# Altium schematic sheet DDR3 RAM.SchDoc
size A3; Organization: Altium Limited; Address1: L3, 12a Rodborough Rd; Address2: Frenchs Forest; Address3: NSW; Address4: Australia 2086
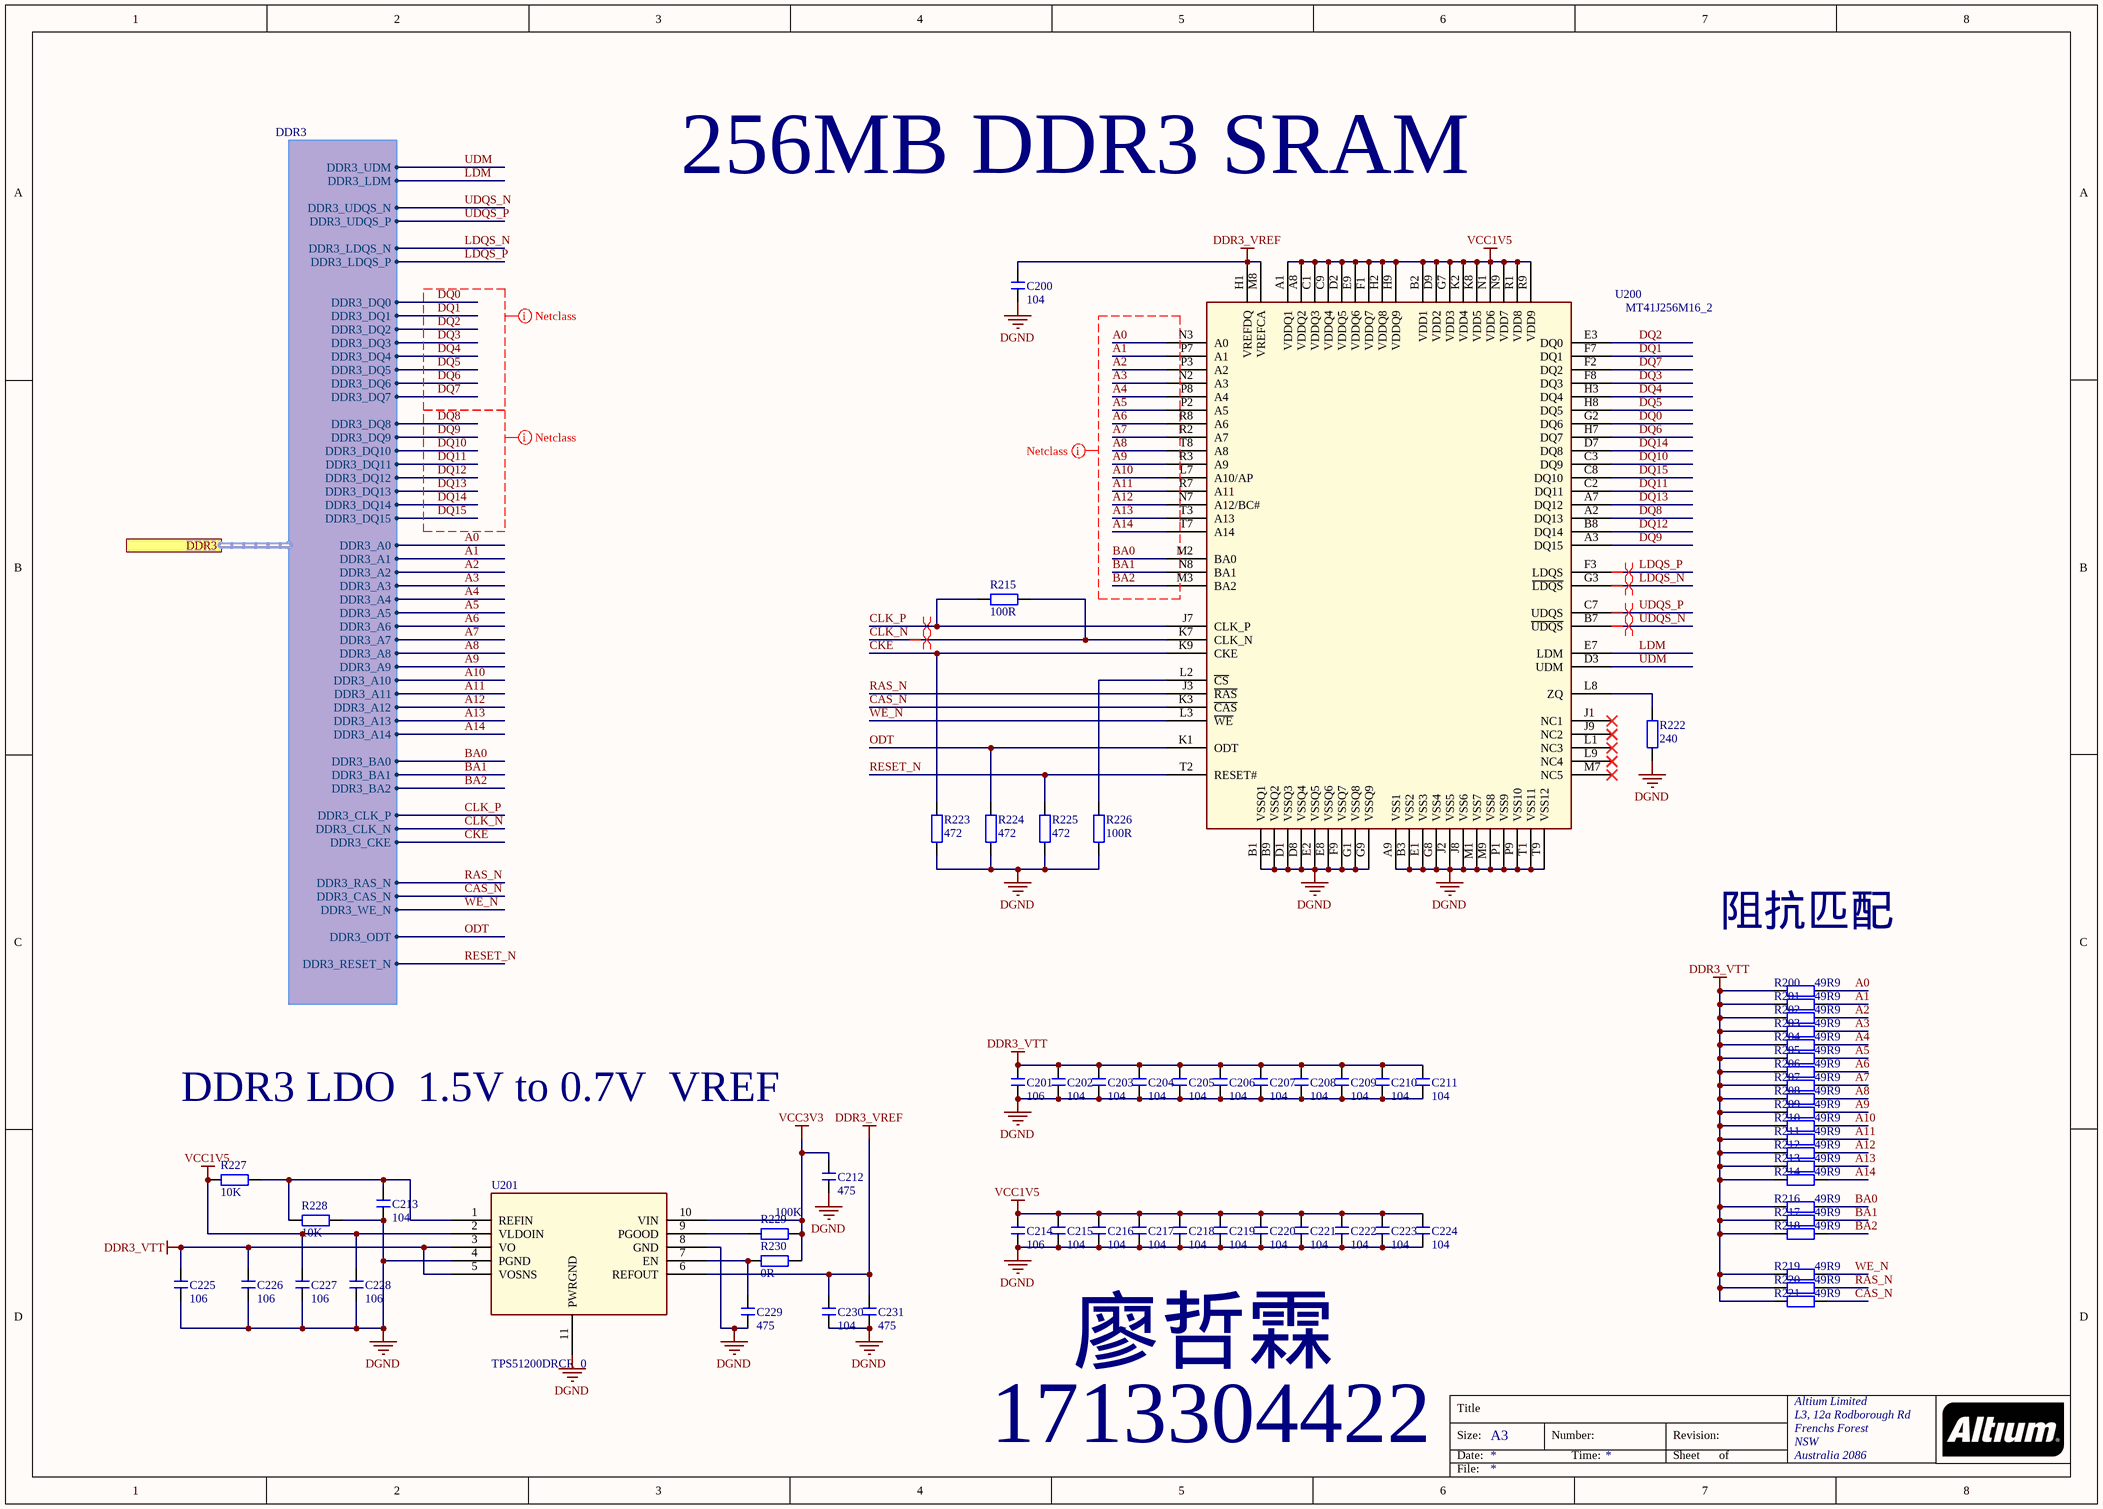
[diagram p0: DDR3 RAM.SchDoc]

## Parts
C200  104  [C 0402_M]
C201  106  [C 0402_M]
C202  104  [C 0402_M]
C203  104  [C 0402_M]
C204  104  [C 0402_M]
C205  104  [C 0402_M]
C206  104  [C 0402_M]
C207  104  [C 0402_M]
C208  104  [C 0402_M]
C209  104  [C 0402_M]
C210  104  [C 0402_M]
C211  104  [C 0402_M]
C212  475  [C 0402_M]
C213  104  [C 0402_M]
C214  106  [C 0402_M]
C215  104  [C 0402_M]
C216  104  [C 0402_M]
C217  104  [C 0402_M]
C218  104  [C 0402_M]
C219  104  [C 0402_M]
C220  104  [C 0402_M]
C221  104  [C 0402_M]
C222  104  [C 0402_M]
C223  104  [C 0402_M]
C224  104  [C 0402_M]
C225  106  [C 0402_M]
C226  106  [C 0402_M]
C227  106  [C 0402_M]
C228  106  [C 0402_M]
C229  475  [C 0402_M]
C230  104  [C 0402_M]
C231  475  [C 0402_M]
R200  49R9  [R 0402_M]
R201  49R9  [R 0402_M]
R202  49R9  [R 0402_M]
R203  49R9  [R 0402_M]
R204  49R9  [R 0402_M]
R205  49R9  [R 0402_M]
R206  49R9  [R 0402_M]
R207  49R9  [R 0402_M]
R208  49R9  [R 0402_M]
R209  49R9  [R 0402_M]
R210  49R9  [R 0402_M]
R211  49R9  [R 0402_M]
R212  49R9  [R 0402_M]
R213  49R9  [R 0402_M]
R214  49R9  [R 0402_M]
R215  100R  [R 0402_M]
R216  49R9  [R 0402_M]
R217  49R9  [R 0402_M]
R218  49R9  [R 0402_M]
R219  49R9  [R 0402_M]
R220  49R9  [R 0402_M]
R221  49R9  [R 0402_M]
R222  240  [R 0402_M]
R223  472  [R 0402_M]
R224  472  [R 0402_M]
R225  472  [R 0402_M]
R226  100R  [R 0402_M]
R227  10K  [R 0402_M]
R228  10K  [R 0402_M]
R229  100K  [R 0402_M]
R230  0R  [R 0402_M]
U200  MT41J256M16_2  [BGA96C80P9X16_750X1350X120]
U201  TPS51200DRCR_0  [SON50P300X300X100-11N-D]

## Ports
DDR3 (harness DDR3)

## Harnesses
DDR3: DDR3_CLK_P, DDR3_CLK_N, DDR3_CKE, DDR3_RAS_N, DDR3_CAS_N, DDR3_WE_N, DDR3_ODT, DDR3_RESET_N, DDR3_A0, DDR3_A1, DDR3_A2, DDR3_A3, DDR3_A4, DDR3_A5, DDR3_A6, DDR3_A7, DDR3_A8, DDR3_A9, DDR3_A10, DDR3_A11, DDR3_A12, DDR3_A13, DDR3_A14, DDR3_BA0, DDR3_BA1, DDR3_BA2, DDR3_LDQS_P, DDR3_LDQS_N, DDR3_LDM, DDR3_UDM, DDR3_UDQS_N, DDR3_UDQS_P, DDR3_DQ0, DDR3_DQ1, DDR3_DQ2, DDR3_DQ3, DDR3_DQ4, DDR3_DQ5, DDR3_DQ6, DDR3_DQ7, DDR3_DQ8, DDR3_DQ9, DDR3_DQ10, DDR3_DQ11, DDR3_DQ12, DDR3_DQ13, DDR3_DQ14, DDR3_DQ15

## Nets
DDR3_VREF: C200.2 C230.2 C231.2 U200.H1(VREFDQ) U200.M8(VREFCA) U201.6(REFOUT)
DDR3_VTT: C201.2 C202.2 C203.2 C204.2 C205.2 C206.2 C207.2 C208.2 C209.2 C210.2 C211.2 C225.2 C226.2 R200.1 R201.1 R202.1 R203.1 R204.1 R205.1 R206.1 R207.1 R208.1 R209.1 R210.1 R211.1 R212.1 R213.1 R214.1 R216.1 R217.1 R218.1 R219.1 R220.1 R221.1 U201.3(VO) U201.5(VOSNS)
DGND: C200.1 C201.1 C202.1 C203.1 C204.1 C205.1 C206.1 C207.1 C208.1 C209.1 C210.1 C211.1 C212.1 C213.1 C214.1 C215.1 C216.1 C217.1 C218.1 C219.1 C220.1 C221.1 C222.1 C223.1 C224.1 C225.1 C226.1 C227.1 C228.1 C229.1 C230.1 C231.1 R222.1 R223.1 R224.1 R225.1 R226.1 R228.2 U200.A9(VSS1) U200.B1(VSSQ1) U200.B3(VSS2) U200.B9(VSSQ2) U200.D1(VSSQ3) U200.D8(VSSQ4) U200.E1(VSS3) U200.E2(VSSQ5) U200.E8(VSSQ6) U200.F9(VSSQ7) U200.G1(VSSQ8) U200.G8(VSS4) U200.G9(VSSQ9) U200.J2(VSS5) U200.J8(VSS6) U200.M1(VSS7) U200.M9(VSS8) U200.P1(VSS9) U200.P9(VSS10) U200.T1(VSS11) U200.T9(VSS12) U201.4(PGND) U201.8(GND) U201.11(PWRGND)
VCC1V5: C214.2 C215.2 C216.2 C217.2 C218.2 C219.2 C220.2 C221.2 C222.2 C223.2 C224.2 C227.2 C228.2 R227.1 U200.A1(VDDQ1) U200.A8(VDDQ2) U200.B2(VDD1) U200.C1(VDDQ3) U200.C9(VDDQ4) U200.D2(VDDQ5) U200.D9(VDD2) U200.E9(VDDQ6) U200.F1(VDDQ7) U200.G7(VDD3) U200.H2(VDDQ8) U200.H9(VDDQ9) U200.K2(VDD4) U200.K8(VDD5) U200.N1(VDD6) U200.N9(VDD7) U200.R1(VDD8) U200.R9(VDD9) U201.2(VLDOIN)
VCC3V3: C212.2 R229.2 R230.2 U201.10(VIN)
A0: R200.2 U200.N3(A0) ; port DDR3.DDR3_A0
A1: R201.2 U200.P7(A1) ; port DDR3.DDR3_A1
A2: R202.2 U200.P3(A2) ; port DDR3.DDR3_A2
A3: R203.2 U200.N2(A3) ; port DDR3.DDR3_A3
A4: R204.2 U200.P8(A4) ; port DDR3.DDR3_A4
A5: R205.2 U200.P2(A5) ; port DDR3.DDR3_A5
A6: R206.2 U200.R8(A6) ; port DDR3.DDR3_A6
A7: R207.2 U200.R2(A7) ; port DDR3.DDR3_A7
A8: R208.2 U200.T8(A8) ; port DDR3.DDR3_A8
A9: R209.2 U200.R3(A9) ; port DDR3.DDR3_A9
A10: R210.2 U200.L7(A10/AP) ; port DDR3.DDR3_A10
A11: R211.2 U200.R7(A11) ; port DDR3.DDR3_A11
A12: R212.2 U200.N7(A12/BC#) ; port DDR3.DDR3_A12
A13: R213.2 U200.T3(A13) ; port DDR3.DDR3_A13
A14: R214.2 U200.T7(A14) ; port DDR3.DDR3_A14
BA0: R216.2 U200.M2(BA0) ; port DDR3.DDR3_BA0
BA1: R217.2 U200.N8(BA1) ; port DDR3.DDR3_BA1
BA2: R218.2 U200.M3(BA2) ; port DDR3.DDR3_BA2
CAS_N: R221.2 U200.K3(~{CAS}) ; port DDR3.DDR3_CAS_N
CKE: R223.2 U200.K9(CKE) ; port DDR3.DDR3_CKE
CLK_N: R215.1 U200.K7(CLK_N) ; port DDR3.DDR3_CLK_N
CLK_P: R215.2 U200.J7(CLK_P) ; port DDR3.DDR3_CLK_P
DQ0: U200.G2(DQ6) ; port DDR3.DDR3_DQ0
DQ1: U200.F7(DQ1) ; port DDR3.DDR3_DQ1
DQ2: U200.E3(DQ0) ; port DDR3.DDR3_DQ2
DQ3: U200.F8(DQ3) ; port DDR3.DDR3_DQ3
DQ4: U200.H3(DQ4) ; port DDR3.DDR3_DQ4
DQ5: U200.H8(DQ5) ; port DDR3.DDR3_DQ5
DQ6: U200.H7(DQ7) ; port DDR3.DDR3_DQ6
DQ7: U200.F2(DQ2) ; port DDR3.DDR3_DQ7
DQ8: U200.A2(DQ13) ; port DDR3.DDR3_DQ8
DQ9: U200.A3(DQ15) ; port DDR3.DDR3_DQ9
DQ10: U200.C3(DQ9) ; port DDR3.DDR3_DQ10
DQ11: U200.C2(DQ11) ; port DDR3.DDR3_DQ11
DQ12: U200.B8(DQ14) ; port DDR3.DDR3_DQ12
DQ13: U200.A7(DQ12) ; port DDR3.DDR3_DQ13
DQ14: U200.D7(DQ8) ; port DDR3.DDR3_DQ14
DQ15: U200.C8(DQ10) ; port DDR3.DDR3_DQ15
LDM: U200.E7(LDM) ; port DDR3.DDR3_LDM
LDQS_N: U200.G3(~{LDQS}) ; port DDR3.DDR3_LDQS_N
LDQS_P: U200.F3(LDQS) ; port DDR3.DDR3_LDQS_P
ODT: R224.2 U200.K1(ODT) ; port DDR3.DDR3_ODT
RAS_N: R220.2 U200.J3(~{RAS}) ; port DDR3.DDR3_RAS_N
RESET_N: R225.2 U200.T2(RESET#) ; port DDR3.DDR3_RESET_N
UDM: U200.D3(UDM) ; port DDR3.DDR3_UDM
UDQS_N: U200.B7(~{UDQS}) ; port DDR3.DDR3_UDQS_N
UDQS_P: U200.C7(UDQS) ; port DDR3.DDR3_UDQS_P
WE_N: R219.2 U200.L3(~{WE}) ; port DDR3.DDR3_WE_N
NetC213_2: C213.2 R227.2 R228.1 U201.1(REFIN)
NetC229_2: C229.2 R230.1 U201.7(EN)
NetR222_2: R222.2 U200.L8(ZQ)
NetR226_2: R226.2 U200.L2(~{CS})
NetR229_1: R229.1 U201.9(PGOOD)

Not connected (* = marked no-connect by the designer): U200 J1(NC1)* J9(NC2)* L1(NC3)* L9(NC4)* M7(NC5)*

## Layout directives
differential pair; differential pair class DDR3; rule Matched Net Lengths [Tolerance = 5mil]: CLK_N, CLK_P, LDQS_N, LDQS_P, UDQS_N, UDQS_P
net class ADDR; rule Matched Net Lengths [Tolerance = 50mil]; rule Width Constraint [Pref Width = 6mil    Min Width = 6mil    Max Width = 10mil]: A0, A1, A2, A3, A4, A5, A6, A7, A8, A9, A10, A11, A12, A13, A14, BA0, BA1, BA2
net class DQ0-DQ7; rule Matched Net Lengths [Tolerance = 50mil]; rule Width Constraint [Pref Width = 6mil    Min Width = 6mil    Max Width = 10mil]: DQ0, DQ1, DQ2, DQ3, DQ4, DQ5, DQ6, DQ7
net class DQ7-DQ15; rule Matched Net Lengths [Tolerance = 50mil]; rule Width Constraint [Pref Width = 6mil    Min Width = 6mil    Max Width = 10mil]: DQ8, DQ9, DQ10, DQ11, DQ12, DQ13, DQ14, DQ15

## Notes on the sheet
- 256MB DDR3 SRAM
- 阻抗匹配
- DDR3 LDO  1.5V to 0.7V  VREF
- 廖哲霖
- 1713304422
- Title
- Size:
- Date:
- A3
- Number:
- Time:
- Revision:
- Sheet
- of
- File:

## Library data of the parts
C200-C231 = C: 无极性贴片电容; 版权归属: 源创客; BOM名称: 无极性贴片电容; 学习资源: www.ooocke.com
R200-R230 = R: 贴片电阻; 版权归属: 源创客; BOM名称: 贴片电阻; 学习资源: www.ooocke.com